# EasyEDA Pro project ProPrj_ESP32辉光钟_2025-08-24.epro, board PCB_IN12Ax4
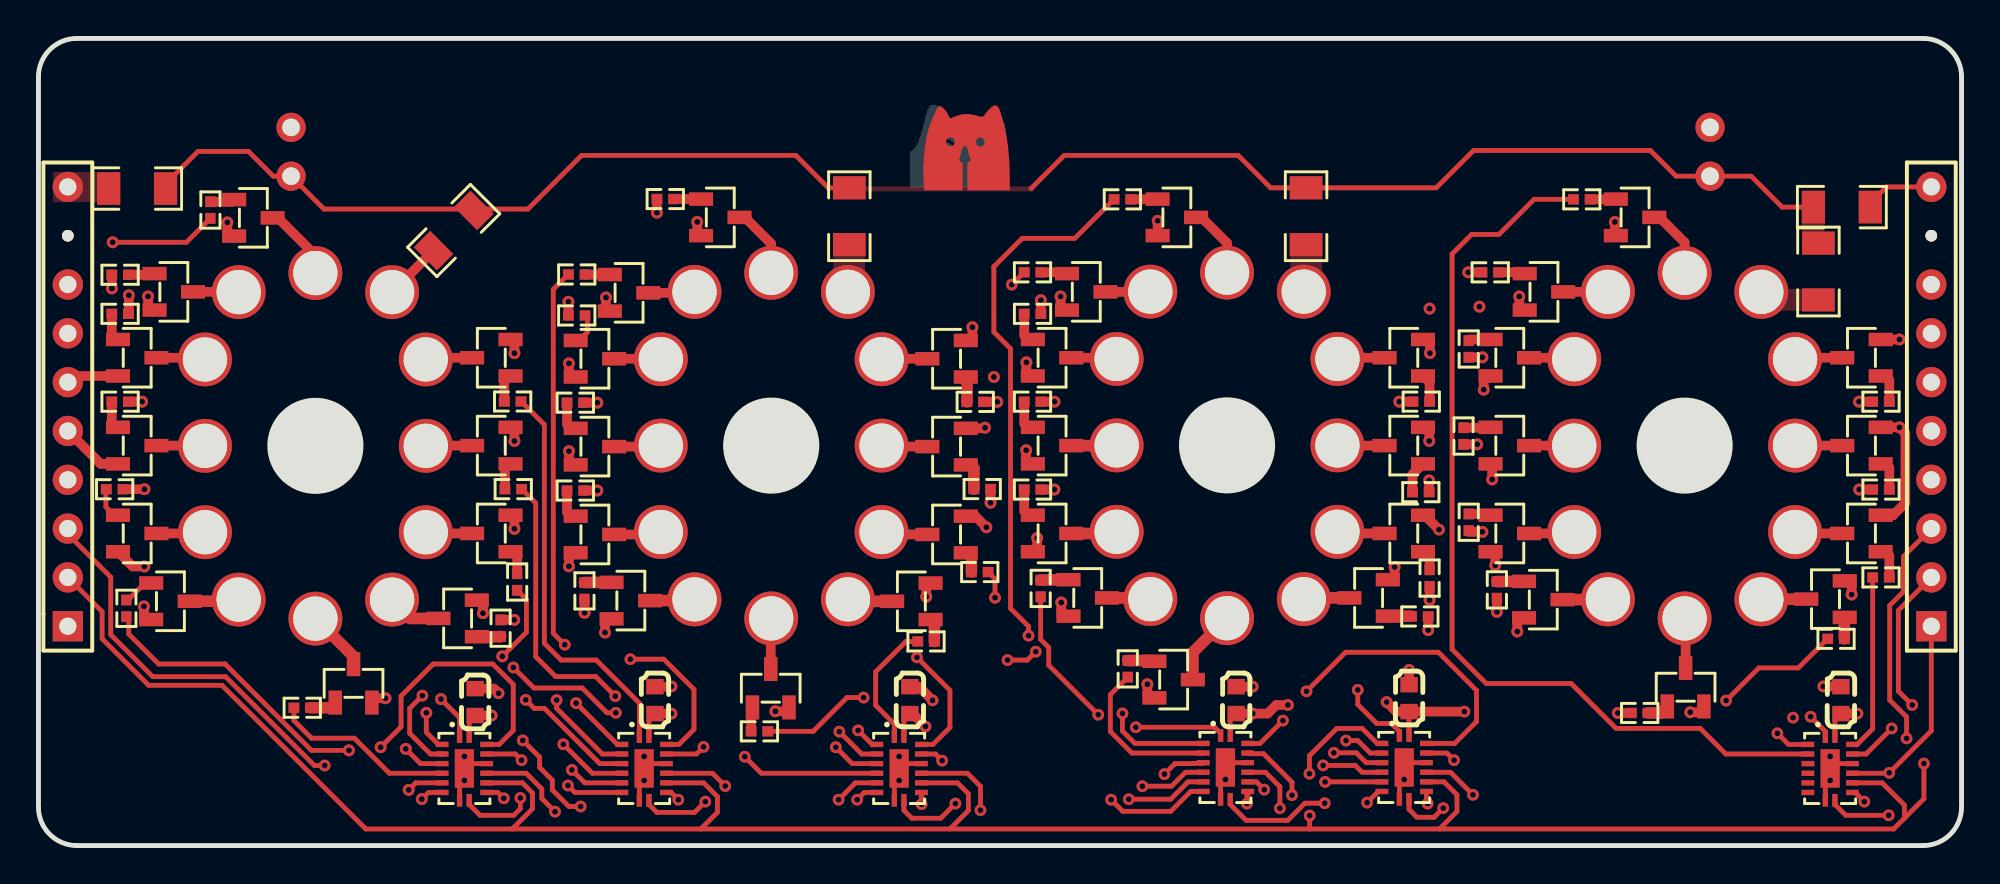
[diagram p4: board, top side]
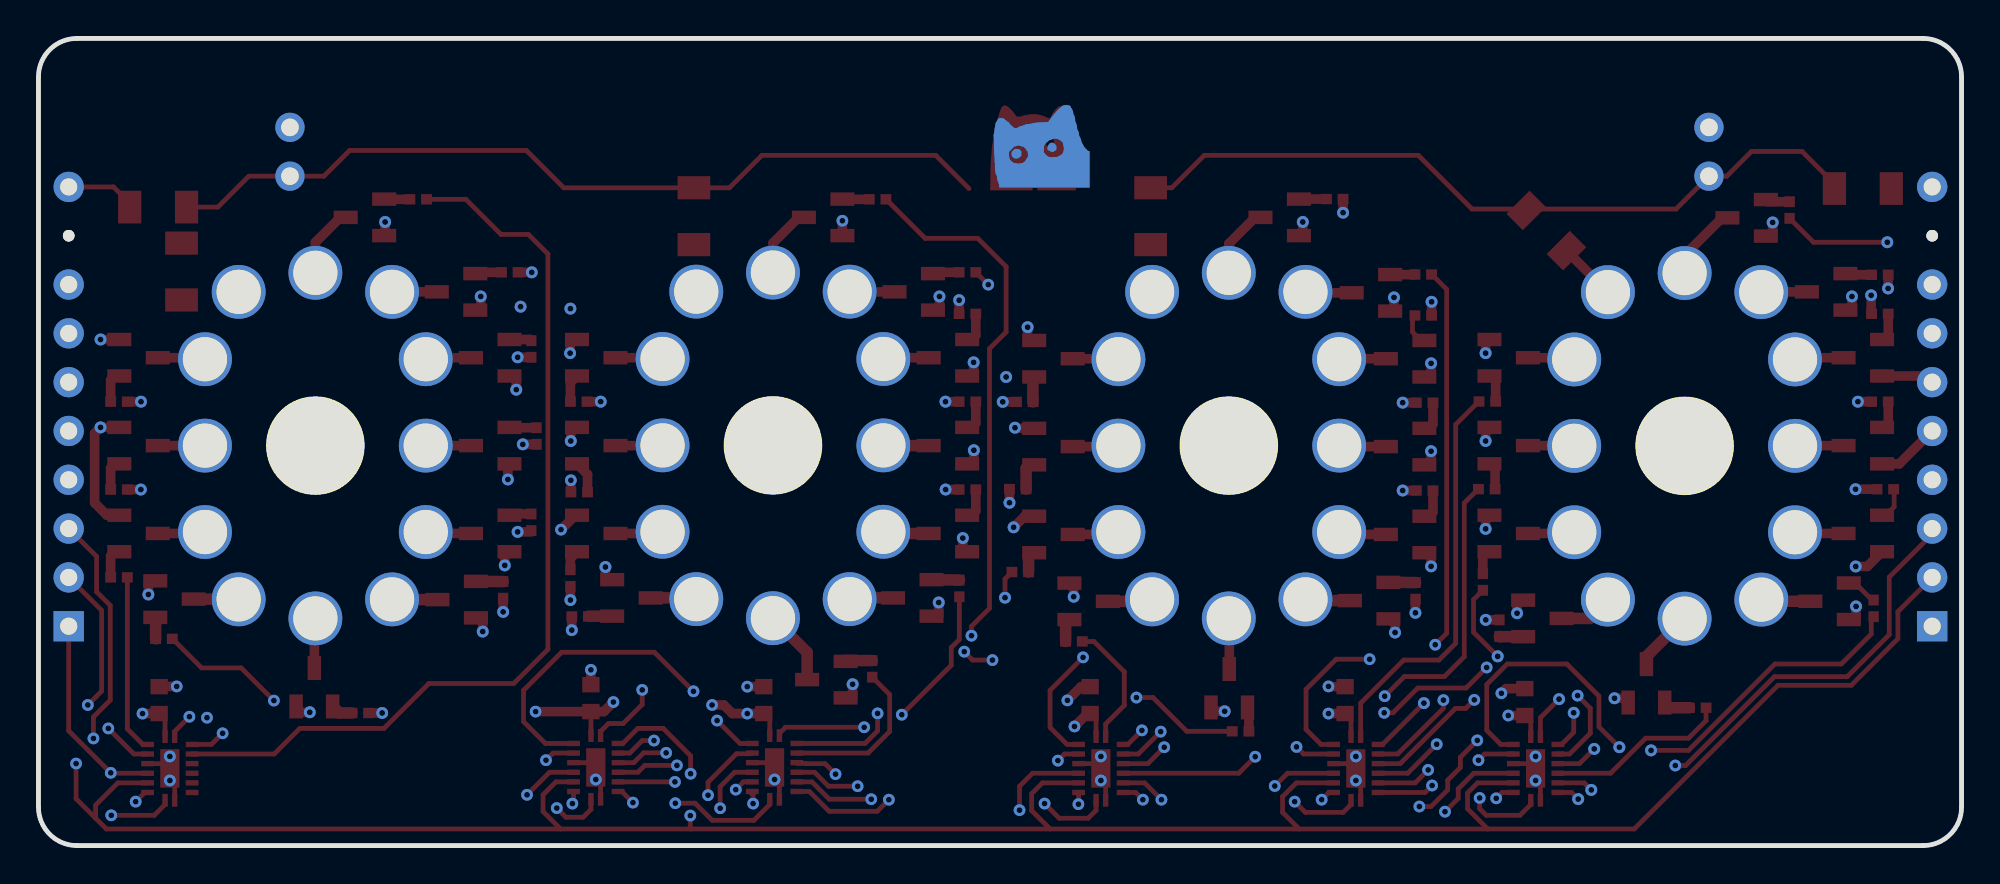
[diagram p5: board, bottom side, seen from below]

Outline 100 x 42 mm; copper layers: Top Layer, Inner1, Inner2, Bottom Layer. Coordinates in mm from the lower left corner of the outline.
Outline path: 0,40 0,2 arc(0.59,0.59) 2,0 98,0 arc(99.41,0.59) 100,2 100,40 arc(99.41,41.41) 98,42 2,42 arc(0.59,41.41) 0,40
Stack: Top Layer 0.035mm / Dielectric1 0.48mm PP er 4.5 / Inner1 0.035mm / Dielectric2 0.48mm FR4 er 4.5 / Inner2 0.035mm / Dielectric3 0.48mm PP er 4.5 / Bottom Layer 0.035mm

## Design rules (mm)
template: 用户自定义配置
spacing Default (default): track to track 0.2, other pairs 0 to 0.5
spacing dis+170v: track to track 0.75, other pairs 0 to 0.75
spacing dis+3v3: track to track 0.2, other pairs 0.152 to 0.3
track width Default (default): min 0.249, default 0.249, max 25.4
track width dis+170v: min 0.249, default 0.249, max 25.4
differential pair differentialPair (default): width min 0.127, default 0.254, max 2.54; gap min 0.152, default 0.152
via Default (default): diameter min 0.61, default 0.61, max 100.025; hole min 0.305, default 0.305, max 59.995
via dis+170v: diameter min 0.61, default 0.61, max 100.025; hole min 0.305, default 0.305, max 59.995
net $1N360 uses dis+170v
net $1N358 uses dis+170v
net $1N361 uses dis+170v
net $1N357 uses dis+170v
net $1N362 uses dis+170v
net $1N356 uses dis+170v
net $1N363 uses dis+170v
net $1N355 uses dis+170v
net $1N364 uses dis+170v
net $1N354 uses dis+170v
net $1N359 uses dis+170v
net $1N275 uses dis+170v
net $1N273 uses dis+170v
net $1N272 uses dis+170v
net $1N271 uses dis+170v
net $1N270 uses dis+170v
net $1N269 uses dis+170v
net $1N268 uses dis+170v
net $1N267 uses dis+170v
net $1N266 uses dis+170v
net $1N265 uses dis+170v
net $1N274 uses dis+170v
net $1N186 uses dis+170v
net $1N184 uses dis+170v
net $1N183 uses dis+170v
net $1N182 uses dis+170v
net $1N181 uses dis+170v
net $1N180 uses dis+170v
net $1N179 uses dis+170v
net $1N178 uses dis+170v
net $1N177 uses dis+170v
net $1N176 uses dis+170v
net $1N185 uses dis+170v
net $1N13 uses dis+170v
net $1N15 uses dis+170v
net $1N16 uses dis+170v
net $1N17 uses dis+170v
net $1N18 uses dis+170v
net $1N19 uses dis+170v
net $1N20 uses dis+170v
net $1N21 uses dis+170v
net $1N22 uses dis+170v
net $1N23 uses dis+170v
net $1N14 uses dis+170v
net PGND uses gge65401(1)
net VCC+180V_EXT1 uses dis+170v
net VCC+180V uses dis+170v
net VCC+180V_EXT2 uses dis+170v

## Placement (name value [footprint] x y rotation side)
C29  10uF  [C0603]  93.73 7.57 270 top
C30  10uF  [C0603]  32.06 7.57 270 top
C31  10uF  [C0603]  45.31 7.57 270 top
C32  10uF  [C0603]  62.28 7.57 270 top
C33  10uF  [C0603]  71.27 7.67 270 top
C34  10uF  [C0603]  22.71 7.47 270 top
DISP1  DISP_IN12A  [_IN12A]  14.4 20.8 180 bottom
DISP2  DISP_IN12A  [_IN12A]  38.1 20.81 180 bottom
DISP4  DISP_IN12A  [_IN12A]  85.6 20.81 180 bottom
DISP5  DISP_IN12A  [_IN12A]  61.81 20.82 180 bottom
J1  HDR-M-2.54_1x10  [HDR-M-2.54_1X10]  98.43 22.84 90 top
J2  HDR-M-2.54_1x10  [HDR-M-2.54_1X10]  1.53 22.84 90 top
NOREF  -  [Pad_e2]  86.92 37.37 0 top
NOREF#2  -  [Pad_e1]  13.14 37.37 0 top
NOREF#3  -  [Pad_e257]  86.92 34.83 180 top
NOREF#4  -  [Pad_e227]  13.14 34.83 180 top
Q4  DMN60H080DS-13  [SOT-23-3_L2.9-W1.3-P1.90-LS2.4-BR]  23.55 25.38 0 top
Q5  DMN60H080DS-13  [SOT-23-3_L2.9-W1.3-P1.90-LS2.4-BR]  7.04 28.81 180 top
Q6  DMN60H080DS-13  [SOT-23-3_L2.9-W1.3-P1.90-LS2.4-BR]  5.13 25.38 180 top
Q7  DMN60H080DS-13  [SOT-23-3_L2.9-W1.3-P1.90-LS2.4-BR]  5.13 20.81 180 top
Q8  DMN60H080DS-13  [SOT-23-3_L2.9-W1.3-P1.90-LS2.4-BR]  5.13 16.24 180 top
Q9  DMN60H080DS-13  [SOT-23-3_L2.9-W1.3-P1.90-LS2.4-BR]  6.86 12.71 180 top
Q10  DMN60H080DS-13  [SOT-23-3_L2.9-W1.3-P1.90-LS2.4-BR]  16.39 8.44 270 top
Q11  DMN60H080DS-13  [SOT-23-3_L2.9-W1.3-P1.90-LS2.4-BR]  21.8 11.82 0 top
Q12  DMN60H080DS-13  [SOT-23-3_L2.9-W1.3-P1.90-LS2.4-BR]  23.55 16.24 0 top
Q13  DMN60H080DS-13  [SOT-23-3_L2.9-W1.3-P1.90-LS2.4-BR]  23.55 20.81 0 top
Q14  DMN60H080DS-13  [SOT-23-3_L2.9-W1.3-P1.90-LS2.4-BR]  47.22 20.76 0 top
Q15  DMN60H080DS-13  [SOT-23-3_L2.9-W1.3-P1.90-LS2.4-BR]  47.22 16.19 0 top
Q16  DMN60H080DS-13  [SOT-23-3_L2.9-W1.3-P1.90-LS2.4-BR]  45.39 12.71 0 top
Q17  DMN60H080DS-13  [SOT-23-3_L2.9-W1.3-P1.90-LS2.4-BR]  38.08 8.19 270 top
Q18  DMN60H080DS-13  [SOT-23-3_L2.9-W1.3-P1.90-LS2.4-BR]  30.8 12.75 180 top
Q19  DMN60H080DS-13  [SOT-23-3_L2.9-W1.3-P1.90-LS2.4-BR]  28.93 16.19 180 top
Q20  DMN60H080DS-13  [SOT-23-3_L2.9-W1.3-P1.90-LS2.4-BR]  28.93 20.76 180 top
Q21  DMN60H080DS-13  [SOT-23-3_L2.9-W1.3-P1.90-LS2.4-BR]  28.93 25.33 180 top
Q22  DMN60H080DS-13  [SOT-23-3_L2.9-W1.3-P1.90-LS2.4-BR]  30.71 28.76 180 top
Q23  DMN60H080DS-13  [SOT-23-3_L2.9-W1.3-P1.90-LS2.4-BR]  47.22 25.33 0 top
Q24  DMN60H080DS-13  [SOT-23-3_L2.9-W1.3-P1.90-LS2.4-BR]  71 20.81 0 top
Q25  DMN60H080DS-13  [SOT-23-3_L2.9-W1.3-P1.90-LS2.4-BR]  71 16.24 0 top
Q26  DMN60H080DS-13  [SOT-23-3_L2.9-W1.3-P1.90-LS2.4-BR]  69.17 12.89 0 top
Q27  DMN60H080DS-13  [SOT-23-3_L2.9-W1.3-P1.90-LS2.4-BR]  59.03 8.64 180 top
Q28  DMN60H080DS-13  [SOT-23-3_L2.9-W1.3-P1.90-LS2.4-BR]  54.56 12.89 180 top
Q29  DMN60H080DS-13  [SOT-23-3_L2.9-W1.3-P1.90-LS2.4-BR]  52.71 16.24 180 top
Q30  DMN60H080DS-13  [SOT-23-3_L2.9-W1.3-P1.90-LS2.4-BR]  52.71 20.81 180 top
Q31  DMN60H080DS-13  [SOT-23-3_L2.9-W1.3-P1.90-LS2.4-BR]  52.71 25.38 180 top
Q32  DMN60H080DS-13  [SOT-23-3_L2.9-W1.3-P1.90-LS2.4-BR]  54.49 28.81 180 top
Q33  DMN60H080DS-13  [SOT-23-3_L2.9-W1.3-P1.90-LS2.4-BR]  71 25.38 0 top
Q34  DMN60H080DS-13  [SOT-23-3_L2.9-W1.3-P1.90-LS2.4-BR]  94.8 20.81 0 top
Q35  DMN60H080DS-13  [SOT-23-3_L2.9-W1.3-P1.90-LS2.4-BR]  94.8 16.24 0 top
Q36  DMN60H080DS-13  [SOT-23-3_L2.9-W1.3-P1.90-LS2.4-BR]  92.93 12.83 0 top
Q37  DMN60H080DS-13  [SOT-23-3_L2.9-W1.3-P1.90-LS2.4-BR]  85.65 8.24 270 top
Q38  DMN60H080DS-13  [SOT-23-3_L2.9-W1.3-P1.90-LS2.4-BR]  78.25 12.8 180 top
Q39  DMN60H080DS-13  [SOT-23-3_L2.9-W1.3-P1.90-LS2.4-BR]  76.51 16.24 180 top
Q40  DMN60H080DS-13  [SOT-23-3_L2.9-W1.3-P1.90-LS2.4-BR]  76.51 20.81 180 top
Q41  DMN60H080DS-13  [SOT-23-3_L2.9-W1.3-P1.90-LS2.4-BR]  76.51 25.38 180 top
Q42  DMN60H080DS-13  [SOT-23-3_L2.9-W1.3-P1.90-LS2.4-BR]  78.29 28.81 180 top
Q43  DMN60H080DS-13  [SOT-23-3_L2.9-W1.3-P1.90-LS2.4-BR]  94.8 25.38 0 top
Q44  DMN60H080DS-13  [SOT-23-3_L2.9-W1.3-P1.90-LS2.4-BR]  83.02 32.69 180 top
Q45  DMN60H080DS-13  [SOT-23-3_L2.9-W1.3-P1.90-LS2.4-BR]  59.2 32.69 180 top
Q46  DMN60H080DS-13  [SOT-23-3_L2.9-W1.3-P1.90-LS2.4-BR]  11.18 32.66 180 top
Q47  DMN60H080DS-13  [SOT-23-3_L2.9-W1.3-P1.90-LS2.4-BR]  35.46 32.69 180 top
R11  20kΩ  [R1206]  21.59 32 45 top
R26  0Ω  [R0402]  4.25 29.7 180 top
R27  0Ω  [R0402]  24.66 23.11 180 top
R28  0Ω  [R0402]  4.25 27.67 180 top
R29  0Ω  [R0402]  4.25 23.1 0 top
R30  0Ω  [R0402]  3.96 18.54 180 top
R31  0Ω  [R0402]  4.57 12.34 270 top
R32  0Ω  [R0402]  13.72 7.17 0 top
R33  0Ω  [R0402]  24.03 11.31 90 top
R34  0Ω  [R0402]  24.89 13.72 90 top
R35  0Ω  [R0402]  24.69 18.55 0 top
R36  0Ω  [R0402]  49.07 18.55 0 top
R37  0Ω  [R0402]  48.95 14.23 180 top
R38  0Ω  [R0402]  46.15 10.62 180 top
R39  0Ω  [R0402]  37.49 5.94 180 top
R40  0Ω  [R0402]  28.39 13.25 270 top
R41  0Ω  [R0402]  27.92 18.47 180 top
R42  0Ω  [R0402]  27.92 23.05 0 top
R43  0Ω  [R0402]  27.99 27.58 0 top
R44  0Ω  [R0402]  48.71 23.09 180 top
R45  0Ω  [R0402]  27.99 29.72 180 top
R46  20kΩ  [R1206]  42.17 32.75 90 top
R47  0Ω  [R0402]  71.88 18.39 0 top
R48  0Ω  [R0402]  72.34 13.92 90 top
R49  0Ω  [R0402]  71.83 11.92 0 top
R50  0Ω  [R0402]  56.64 9.19 90 top
R51  0Ω  [R0402]  52.11 13.38 270 top
R52  0Ω  [R0402]  51.69 18.53 180 top
R53  0Ω  [R0402]  51.69 23.1 0 top
R54  0Ω  [R0402]  51.69 27.67 180 top
R55  0Ω  [R0402]  71.91 23.1 0 top
R56  0Ω  [R0402]  51.69 29.83 180 top
R57  20kΩ  [R1206]  65.92 32.75 90 top
R58  0Ω  [R0402]  95.81 18.53 180 top
R59  0Ω  [R0402]  95.81 13.95 0 top
R60  0Ω  [R0402]  93.47 10.76 180 top
R61  0Ω  [R0402]  83.26 6.9 0 top
R62  0Ω  [R0402]  75.84 13.31 270 top
R63  0Ω  [R0402]  74.37 16.82 90 top
R64  0Ω  [R0402]  74.1 21.31 270 top
R65  0Ω  [R0402]  74.37 25.84 90 top
R66  0Ω  [R0402]  95.81 23.1 0 top
R67  0Ω  [R0402]  75.49 29.83 180 top
R68  20kΩ  [R1206]  92.56 29.87 90 top
R69  NULL  [R1206]  93.78 33.22 0 top
R70  NULL  [R1206]  5.13 34.19 180 top
R71  0Ω  [R0402]  80.25 33.63 180 top
R72  0Ω  [R0402]  56.37 33.63 180 top
R73  0Ω  [R0402]  8.94 33.07 270 top
R74  0Ω  [R0402]  32.59 33.64 180 top
U7  74HC595BQ,115  [DHVQFN-16_L3.5-W2.5-P0.50-BL-EP]  71.02 4.06 270 top
U8  74HC595BQ,115  [DHVQFN-16_L3.5-W2.5-P0.50-BL-EP]  61.72 4.06 270 top
U9  74HC595BQ,115  [DHVQFN-16_L3.5-W2.5-P0.50-BL-EP]  44.75 4.01 270 top
U10  74HC595BQ,115  [DHVQFN-16_L3.5-W2.5-P0.50-BL-EP]  31.5 4.01 270 top
U11  74HC595BQ,115  [DHVQFN-16_L3.5-W2.5-P0.50-BL-EP]  22.15 4.01 270 top
U12  74HC595BQ,115  [DHVQFN-16_L3.5-W2.5-P0.50-BL-EP]  93.17 4.01 270 top

## Footprints (pads in the part's own frame, mm; a bottom-side part is the same pattern mirrored in y, then rotated)
_IN12A
  round 2.8 hole 2.301: 1(-3.988,8.001) 2(-5.74,4.496) 3(-5.74,0) 4(-5.74,-4.496) 5(-3.988,-8.001) 6(0,-8.992) 7(3.988,-8.001) 8(5.74,-4.496) 9(5.74,0) 10(5.74,4.496) 11(3.988,8.001) 12(0,8.992)
C0603
  rect 0.8x0.9 smd: 1(-0.7,0) 2(0.7,0)
DHVQFN-16_L3.5-W2.5-P0.50-BL-EP
  rect 0.665x0.28 smd: 1(-1.657,-0.25) 8(1.657,-0.25) 9(1.657,0.25) 16(-1.657,0.25)
  rect 0.28x0.665 smd: 2(-1.25,-1.157) 3(-0.75,-1.157) 4(-0.25,-1.157) 5(0.25,-1.157) 6(0.75,-1.157) 7(1.25,-1.157) 10(1.25,1.157) 11(0.75,1.157) 12(0.25,1.157) 13(-0.25,1.157) 14(-0.75,1.157) 15(-1.25,1.157)
  rect 2x1 smd: 17(0,0)
HDR-M-2.54_1X10
  rect 1.575x1.575 hole 0.889: 1(-11.43,0)
  round 1.575 hole 0.889: 2(-8.89,0) 3(-6.35,0) 4(-3.81,0) 5(-1.27,0) 6(1.27,0) 7(3.81,0) 8(6.35,0) 10(11.43,0)
  round 0.6 hole 0.8: 9(8.89,0)
Pad_e1
  round 1.524 hole 0.914: 1(0,0)
Pad_e2
  round 1.524 hole 0.914: 1(0,0)
Pad_e227
  round 1.524 hole 0.914: 1(0,0)
Pad_e257
  round 1.524 hole 0.914: 1(0,0)
R0402
  rect 0.566x0.54 smd: 1(-0.433,0) 2(0.433,0)
R1206
  rect 1.208x1.701 smd: 1(-1.479,0) 2(1.479,0)
SOT-23-3_L2.9-W1.3-P1.90-LS2.4-BR
  rect 1.25x0.7 smd: 1(1,-0.95) 2(1,0.95) 3(-1,0)

## Nets
As in the schematic, except:
PGND: C29.1 C30.1 C31.1 C32.1 C33.1 C34.1 J1.5 J1.6 J1.7 J1.8 J2.5 J2.6 J2.7 J2.8 Q4.2 Q5.2 Q6.2 Q7.2 Q8.2 Q9.2 Q10.2 Q11.2 Q12.2 Q13.2 Q14.2 Q15.2 Q16.2 Q17.2 Q18.2 Q19.2 Q20.2 Q21.2 Q22.2 Q23.2 Q24.2 Q25.2 Q26.2 Q27.2 Q28.2 Q29.2 Q30.2 Q31.2 Q32.2 Q33.2 Q34.2 Q35.2 Q36.2 Q37.2 Q38.2 Q39.2 Q40.2 Q41.2 Q42.2 Q43.2 Q44.2 Q45.2 Q46.2 Q47.2 U7.8 U7.13 U7.17 U8.8 U8.13 U8.17 U9.8 U9.13 U9.17 U10.8 U10.13 U10.17 U11.8 U11.13 U11.17 U12.8 U12.13 U12.17
VCC+180V: NOREF#3.1 NOREF#4.1 R11.2 R46.2 R57.2 R68.2 R69.1 R70.1

Pads without a net: J1 9; J2 9; NOREF 1; NOREF#2 1

## Via types
v1: diameter 0.61, hole 0.305, Top Layer to Bottom Layer, 92 vias
v2: diameter 0.62, hole 0.31, Top Layer to Bottom Layer, 89 vias

## Routing (per net, layer and track width the routed paths; a pad name or vN(x,y) marks a point on that pad's centre or on a via; arc(x,y) is an arc through that point)
PGND: length 406.5
  Top Layer w0.249: U10.13 31.75,4.26 U10.17 31.25,3.76 U10.8 ; U11.8 21.9,3.76 U11.17 22.4,4.26 U11.13 ; U7.13 71.27,4.31 U7.17 70.77,3.81 U7.8 ; v2(44.75,3.39) 44.5,3.14 U9.8 ; U8.17 61.97,4.31 U8.13 ; U12.17 93.42,4.26 U12.13 ; U9.13 45,4.26 U9.17 ; v2(93.17,3.39) 92.92,3.14 92.92,2.36 ; v2(61.72,3.44) 61.47,3.19 U8.8
  Top Layer w0.5: 27.58,19.81 v2(27.58,20.52) ; v1(46.5,7.56) 45.78,8.27 C31.1 ; 24.75,17.19 v2(24.75,16.48) ; v2(70.52,14.5) 70.52,13.99 70.37,13.84 ; 9.82,31.71 v2(9.82,32.42) ; C29.1 93.72,8.28 v1(92.81,8.28) ; Q8.2 4.9,14.52 v2(5.5,14.52) ; Q35.2 96.44,17.19 97.08,17.83 97.08,21.46 v2(96.77,21.76) 96.06,21.76 ; v1(32.92,8.28) 32.91,8.27 C30.1 ; 51.36,19.86 v2(51.36,20.57) ; 34.26,31.74 v2(34.26,32.45) ; v1(23.93,7.92) 23.68,8.17 C34.1 ; J2.5 3.24,19.86 Q7.2 ; 24.75,21.76 v2(24.75,21.05) ; 48.56,26.26 v2(48.56,26.97) ; J2.6 1.85,24.43 Q6.2 ; C33.1 v1(71.27,9.14) ; 77,27.86 v2(77,28.57) ; 57.66,7.69 v2(57.66,8.4) ; 17.33,7.67 v2(18.05,7.67) ; C32.1 v1(63.14,8.27) ; 5.49,11.73 v2(5.49,12.44) ; v2(49.22,21.74) 49.19,21.71 Q14.2 ; Q45.2 v1(58.2,32.51) ; 27.58,15.24 v2(27.58,14.53) ; 24.75,26.33 v2(24.75,25.62) ; 53.15,27.86 v2(53.15,28.57) ; 29.46,11.8 v2(29.46,11.09) ; v2(49.29,16.56) 48.71,17.14 Q15.2 ; 72.32,21.76 v2(72.32,21.05) ; 94.28,13.78 v2(94.28,13.06) ; 75.16,24.43 v2(75.16,23.72) ; 81.97,31.74 v2(81.97,32.45) ; 96.06,26.33 v2(96.77,26.33) ; 76.9,11.85 v2(76.9,11.14) ; 75.75,15.29 v2(75.75,14.58) ; 5.7,27.86 v2(5.7,28.57) ; 27.58,24.38 v2(27.58,25.09) ; 23.11,12.8 v2(23.11,12.09) ; 39.03,6.99 v2(38.32,6.99) ; 51.93,15.29 v2(51.93,16) ; 72.36,26.33 v2(72.36,25.62) ; 86.6,6.94 v2(85.89,6.94) ; 53.19,11.94 v2(53.19,12.65) ; 29.51,27.81 v2(29.51,28.52) ; 51.37,24.43 v2(51.37,25.14) ; 46.17,13.66 v2(46.17,12.95) ; Q25.2 72.08,17.19 v1(72.83,16.44) ; 75.59,19.76 v2(75.59,19.05)
  Inner1 w0.5: v1(58.2,32.51) 55.37,32.51 54.31,31.44 52.41,31.44 51.34,30.38 ; 71.27,13.74 72.83,15.3 ; 71.27,13.74 v2(70.52,14.5) ; 71.27,13.74 v1(71.27,9.14) ; 72.83,15.3 v1(72.83,16.44) 73.3,16.92 ; 72.83,15.3 75.03,15.3 v2(75.75,14.58) ; 53.19,10.16 54.95,8.4 v2(57.66,8.4) 59.15,6.91 61.06,6.91 62.42,8.27 v1(63.14,8.27) ; 53.19,10.16 v2(53.19,12.65) 51.77,12.65 51.1,13.31 51.1,15.17 v2(51.93,16) 50.85,17.08 50.85,20.06 v2(51.36,20.57) ; 53.19,10.16 50.58,7.56 v1(46.5,7.56) ; v2(24.75,25.62) v2(24.75,21.05) v2(24.75,16.48) 24.75,13.73 v2(23.11,12.09) 23.11,8.74 23.27,8.58 ; 51.34,30.38 v2(53.15,28.57) ; 51.34,30.38 50.14,30.38 48.56,28.8 v2(48.56,26.97) ; 92.39,9.38 94.28,11.28 v2(94.28,13.06) 95.76,14.54 95.76,20.75 v2(96.77,21.76) 98.24,21.76 J1.5 J1.6 J1.7 J1.8 ; 92.39,9.38 91.34,8.33 87.29,8.33 v2(85.89,6.94) 83.23,6.94 82.45,7.72 78.94,7.72 76.9,9.77 v2(76.9,11.14) 74.48,11.14 73.46,10.11 72.24,10.11 v1(71.27,9.14) ; 92.39,9.38 92.81,8.96 v1(92.81,8.28) ; 48.11,11.01 48.11,15.38 v2(49.29,16.56) 48.56,17.29 48.56,21.09 v2(49.22,21.74) 48.56,22.4 v2(48.56,26.97) ; 48.11,11.01 v2(46.17,12.95) ; 48.11,11.01 48.11,9.17 v1(46.5,7.56) ; v2(48.56,26.97) 49.54,26.97 v2(51.37,25.14) ; 5.69,30.58 2.92,30.58 J2.8 J2.7 J2.6 J2.5 4.42,18.68 4.42,15.61 v2(5.5,14.52) 5.5,12.46 v2(5.49,12.44) 5.49,10.92 7.31,9.09 10.77,9.09 12.85,7.01 17.39,7.01 v2(18.05,7.67) 18.96,8.58 23.27,8.58 ; 5.69,30.58 6.4,31.29 7.77,31.29 8.64,32.16 9.55,32.16 v2(9.82,32.42) ; 5.69,30.58 5.69,28.58 v2(5.7,28.57) ; v1(63.14,8.27) 64.91,8.27 65.79,9.14 v1(71.27,9.14) ; v1(63.14,8.27) 63.9,7.51 63.9,5.62 v2(61.72,3.44) ; 29.46,9.95 30.47,8.94 32.26,8.94 v1(32.92,8.28) 34.21,6.99 v2(38.32,6.99) 40.57,6.99 42.06,8.48 45.57,8.48 v1(46.5,7.56) ; 29.46,9.95 v2(29.46,11.09) 29.45,11.07 28.36,11.07 27.58,11.85 v2(27.58,14.53) v2(27.58,20.52) v2(27.58,25.09) 27.58,26.59 v2(29.51,28.52) 29.51,30.02 31.24,31.75 33.56,31.75 v2(34.26,32.45) ; 29.46,9.95 27.94,8.43 24.44,8.43 v1(23.93,7.92) 23.27,8.58 ; v2(75.16,23.72) 75.59,23.29 v2(75.59,19.05) 75.44,19.05 73.3,16.92 ; v1(71.27,9.14) 72.39,8.03 72.39,6.45 71.02,5.08 v2(71.02,3.44) ; 73.3,16.92 73.3,20.07 v2(72.32,21.05) 72.32,25.59 v2(72.36,25.62) 74.05,25.62 v2(77,28.57) 77,30.47 78.98,32.45 v2(81.97,32.45) ; v2(93.17,4.64) 92.24,4.64 91.24,5.64 v1(91.24,6.66) ; v2(96.77,26.33) 96.77,21.76
  Inner2 w0.5: v2(44.75,4.64) 45.84,4.64 46.89,5.69 46.89,7.16 v1(46.5,7.56) ; v1(32.92,8.28) 33.78,7.42 33.78,6.45 31.97,4.64 v2(31.5,4.64) ; v1(91.24,6.66) 91.24,7.26 92.25,8.28 v1(92.81,8.28) ; v1(23.93,7.92) 24.59,7.26 24.59,5.94 23.28,4.64 v2(22.15,4.64)
  vias: v2(22.15,3.39) v2(31.5,3.39) v2(49.68,24.38) v2(72.34,27.94) v2(74.93,28.04)
VCC+3V3: length 178
  Top Layer w0.249: C34.2 22.4,6.46 22.4,5.67 ; v1(62.84,2.18) 62.84,2.63 63.02,2.81 U8.10 ; 93.42,5.67 93.42,6.56 C29.2 ; v1(72.24,2.18) 72.18,2.25 U7.10 ; v1(45.92,2.15) 45.91,2.16 U9.10 ; v1(33.27,2.39) 32.9,2.76 U10.10 ; U12.10 94.47,2.76 v1(94.94,2.29) ; U11.10 23.89,2.76 v1(24.2,2.46) ; C31.2 45,6.56 45,5.67 ; 31.75,5.67 31.75,6.56 C30.2 ; C32.2 61.97,6.56 U8.16 ; U7.16 71.27,6.97 C33.2
  Top Layer w0.5: C29.2 v1(94.59,6.87) ; C31.2 45.46,6.87 v1(46.13,6.2) ; v1(70.1,7.47) 70.6,6.97 C33.2 v1(74.15,6.97) ; v1(64.97,7.31) 64.36,7.31 63.92,6.87 v1(63.14,6.87) C32.2 ; C34.2 v1(23.57,6.77) ; C30.2 v1(32.92,6.87)
  Inner1 w0.249: v1(94.59,6.87) 93.93,6.21 93.93,3.3 v1(94.94,2.29)
  Inner1 w0.5: v1(62.84,2.18) 61.47,2.18 60.81,2.84 60.81,5.2 ; J2.4 3.72,16.84 3.72,15.28 4.62,14.38 4.62,10.72 7.01,8.33 10.54,8.33 12.57,6.3 19.3,6.3 19.8,5.8 21.14,5.8 22.1,6.76 23.56,6.76 v1(23.57,6.77) 27.37,6.77 28.55,5.59 31.64,5.59 v1(32.92,6.87) 33.74,6.05 40.69,6.05 41.59,6.95 45.38,6.95 v1(46.13,6.2) 54.05,6.2 55.05,5.2 60.81,5.2 ; 60.81,5.2 62.48,6.87 v1(63.14,6.87) ; J1.4 96.46,17.06 96.46,8.74 v1(94.59,6.87) 93.94,7.52 89.61,7.52 88.19,6.1 81.84,6.1 80.96,6.97 v1(74.15,6.97) ; v1(64.97,7.31) 65.48,6.81 69.44,6.81 v1(70.1,7.47)
  Inner2 w0.249: v1(32.92,6.87) 30.9,6.87 30.07,6.05 30.07,3.66 31.34,2.39 v1(33.27,2.39) ; v1(74.15,6.97) 71.78,4.6 71.78,2.64 v1(72.24,2.18) ; v1(45.92,2.15) 45.04,2.15 44.09,3.1 44.09,5.39 44.91,6.2 v1(46.13,6.2) ; v1(24.2,2.46) 22.13,2.46 21.28,3.3 21.28,4.93 22.35,5.99 22.8,5.99 v1(23.57,6.77)
VCC+180V: length 83.8
  Top Layer w0.249: R69.1 90.67,33.22 89.06,34.83 NOREF#3.1 85.16,34.83 83.82,36.17 74.62,36.17 72.68,34.23 R57.2 64.07,34.23 62.38,35.92 53.34,35.92 51.61,34.19 ; 22.56,33.12 14.85,33.12 NOREF#4.1 12.21,34.83 10.92,36.12 8.29,36.12 6.61,34.44 R70.1 ; 22.56,33.12 25.45,33.12 28.25,35.92 39.38,35.92 41.07,34.23 R46.2 ; 22.56,33.12 R11.2
VCC+180V_EXT1: length 3.7
  Top Layer w0.249: R69.2 95.26,33.43 96.1,34.27 J1.10
CLK: length 144.6
  Top Layer w0.249: 47.4,0.86 48.35,1.82 48.35,2.7 47.79,3.26 U9.11 ; 47.4,0.86 34.44,0.86 ; 47.4,0.86 66.09,0.86 ; 97.03,1.42 96.47,0.86 72.85,0.86 ; 97.03,1.42 98.04,2.44 v1(98.04,4.27) ; 97.03,1.42 97.03,2.11 95.87,3.26 U12.11 ; v1(63.74,2.91) 63.34,3.31 U8.11 ; J1.2 96.72,12.24 96.72,8.03 v1(97.43,7.31) ; 34.44,0.86 35.31,1.73 35.31,2.55 34.59,3.26 U10.11 ; 34.44,0.86 24.64,0.86 ; 66.09,0.86 66.1,0.88 v1(66.1,1.56) ; 66.09,0.86 72.85,0.86 ; 72.85,0.86 73.76,1.77 73.76,2.64 73.09,3.31 U7.11 ; 24.64,0.86 25.69,1.91 25.69,2.74 25.16,3.26 U11.11 ; 24.64,0.86 17.02,0.86 9.54,8.34 5.73,8.34 3.31,10.76 3.31,12.17 J2.2
  Inner2 w0.249: v1(97.43,7.31) 98.04,6.71 v1(98.04,4.27) ; v1(66.1,1.56) 66.1,2.83 65.68,3.25 64.08,3.25 v1(63.74,2.91)
DI: length 36.9
  Top Layer w0.249: v1(14.88,4.17) 14.35,4.17 9.73,8.79 5.94,8.79 3.76,10.97 3.76,13.97 1.53,16.2 J2.3 ; U11.14 24.8,4.76 v1(25.12,4.44)
  Inner2 w0.249: v1(14.88,4.17) 17.28,1.77 25.24,1.77 25.81,2.34 25.81,3.76 v1(25.12,4.44)
DQ: length 19.8
  Top Layer w0.249: U12.9 93.42,2.14 93.98,1.57 v1(96.22,1.57) ; J1.3 96.98,15.04 96.98,13.21 96.27,12.5 96.27,7.57 97.14,6.69 v1(97.14,5.58)
  Inner2 w0.249: v1(96.22,1.57) 97.14,2.5 v1(97.14,5.58)
EN00: length 21.1
  Top Layer w0.249: 31.25,5.67 31.25,7.41 29.01,9.65 27.18,9.65 26.31,10.52 26.31,21.9 25.1,23.11 R27.1
EN01: length 50.2
  Top Layer w0.249: U11.15 23.96,5.26 24.69,5.99 24.69,8.38 23.62,9.45 20.52,9.45 18.86,7.78 18.86,6.18 v2(17.79,5.12)
  Top Layer w0.5: 3.82,29.7 v2(3.82,28.99)
  Inner2 w0.249: v2(3.82,28.99) 3.81,28.98 3.81,27.43 4.25,26.99 4.25,21.17 3.34,20.26 3.34,11.08 6.35,8.08 10.16,8.08 12.65,5.59 17.32,5.59 v2(17.79,5.12)
EN02: length 41.6
  Top Layer w0.249: 21.9,5.67 21.9,6.65 v2(20.93,7.62)
  Top Layer w0.5: R28.1 4.7,27.69 v2(4.7,28.63)
  Inner2 w0.249: v2(4.7,28.63) 4.7,20.91 3.79,20 3.79,11.27 6.54,8.53 10.35,8.53 12.83,6.04 20.26,6.04 20.93,6.71 v2(20.93,7.62)
EN03: length 33.1
  Top Layer w0.249: v2(20.17,6.91) 20.17,5.89 20.8,5.26 U11.2
  Top Layer w0.5: R29.2 v2(5.39,23.1)
  Inner2 w0.249: v2(5.39,23.1) 5.39,19.76 4.24,18.62 4.24,11.45 6.72,8.97 10.53,8.97 13.02,6.49 19.75,6.49 v2(20.17,6.91)
EN04: length 30.3
  Top Layer w0.249: v1(19.96,7.8) 19.3,7.14 19.3,5.84 20.38,4.76 U11.3
  Top Layer w0.5: 4.39,18.54 v2(5.51,18.54)
  Inner2 w0.249: v1(19.96,7.8) 19.1,6.94 13.21,6.94 10.72,9.42 6.91,9.42 4.69,11.64 4.69,17.72 v2(5.51,18.54)
EN05: length 20.7
  Top Layer w0.249: U11.4 19.87,4.26 v2(19.1,5.03) ; v2(16.15,4.95) 14.2,4.95 9.7,9.45 6.25,9.45 4.69,11 4.69,11.95
  Inner2 w0.249: v2(16.15,4.95) 16.83,4.27 18.34,4.27 v2(19.1,5.03)
EN06: length 9.5
  Top Layer w0.249: U11.5 18.25,3.76 16.43,5.59 14.2,5.59 13.29,6.5 13.29,7.17
EN07: length 13.7
  Top Layer w0.249: U11.6 19.62,3.26 v2(19.25,2.9)
  Top Layer w0.5: R33.2 v2(24.74,11.74)
  Inner2 w0.249: v2(24.74,11.74) 21.59,8.59 21.59,6.5 19.25,4.17 v2(19.25,2.9)
EN08: length 14.5
  Top Layer w0.249: U11.7 20.28,2.76 v2(19.93,2.42) ; 24.89,13.28 25.38,12.8 25.38,11.1 v2(24.12,9.85)
  Inner2 w0.249: v2(24.12,9.85) 22.04,7.76 22.04,6.32 19.93,4.21 v2(19.93,2.42)
EN09: length 24.1
  Top Layer w0.249: v1(30.78,9.7) 32.52,9.7 34.09,8.13 34.09,6.05 33.3,5.26 U10.15 ; R35.2 25.13,18.55 25.86,17.82 25.86,9.83 26.89,8.8 28.97,8.8 v1(30,7.77)
  Inner2 w0.249: v1(30.78,9.7) 30.78,8.56 v1(30,7.77)
EN10: length 26.3
  Top Layer w0.249: v1(41.46,5.12) 42.31,4.26 U9.4
  Top Layer w0.5: R44.1 v2(49.86,23.09)
  Inner2 w0.249: v2(49.86,23.09) 49.86,19.12 48.66,17.92 48.66,11.88 43.85,7.07 41.79,7.07 40.98,6.25 40.98,5.6 v1(41.46,5.12)
EN010: length 63.4
  Top Layer w0.249: v2(3.86,31.39) 7.7,31.39 R73.2 ; U10.2 30.11,5.26 v2(27.96,7.41)
  Inner2 w0.249: v2(27.96,7.41) 27.96,5.05 26.26,3.34 26.26,2.15 25.43,1.32 16.07,1.32 9.77,7.62 6.17,7.62 2.9,10.9 2.9,28.97 3.86,29.93 v2(3.86,31.39)
EN11: length 27.7
  Top Layer w0.249: v1(27.37,10.45) 26.77,11.05 26.77,28.94 27.55,29.72 R45.2 ; U10.3 29.32,4.76 26.94,7.14 v1(26.94,7.57)
  Inner2 w0.249: v1(27.37,10.45) 26.94,10.03 v1(26.94,7.57)
EN12: length 28.7
  Top Layer w0.249: v1(25.34,7.58) 25.78,7.14 26.31,7.14 29.19,4.26 U10.4
  Top Layer w0.5: R43.1 v2(27.56,28.29)
  Inner2 w0.249: v2(27.56,28.29) 25.86,26.59 25.86,8.1 v1(25.34,7.58)
EN13: length 23.7
  Top Layer w0.249: U10.5 28.8,3.76 v1(27.29,5.27)
  Top Layer w0.5: 28.35,23.05 v2(29.06,23.05)
  Inner2 w0.249: v1(27.29,5.27) 26.31,6.25 26.31,20.3 v2(29.06,23.05)
EN14: length 20.3
  Top Layer w0.249: U10.6 28.41,3.26 v1(27.74,3.94)
  Top Layer w0.5: 28.35,18.47 v2(29.06,18.47)
  Inner2 w0.249: v1(27.74,3.94) 28.75,4.95 28.75,9.96 26.76,11.95 26.76,16.18 v2(29.06,18.47)
EN15: length 14.2
  Top Layer w0.249: v1(27.53,3.13) 27.89,2.76 U10.7
  Top Layer w0.5: 28.4,12.82 v2(28.4,12.11)
  Inner2 w0.249: v2(28.4,12.11) 28.4,10.95 29.31,10.03 29.31,4.11 28.32,3.13 v1(27.53,3.13)
EN16: length 15.6
  Top Layer w0.249: R39.1 40.28,5.94 42.04,7.7 v1(42.91,7.7) ; v1(45.68,9.79) 47.4,8.08 47.4,6.15 46.51,5.26 U9.15
  Inner2 w0.249: v1(42.91,7.7) 43.59,7.7 v1(45.68,9.79)
EN17: length 6.6
  Top Layer w0.249: 44.5,5.67 44.5,6.33 43.54,7.3 43.54,9.04 45.11,10.62 45.72,10.62 R38.2
EN18: length 13.4
  Top Layer w0.249: v2(49.74,12.9) 49.74,13.87 R37.1 ; U9.2 43.35,5.26 v1(42.62,5.99)
  Inner2 w0.249: v2(49.74,12.9) 49.74,11.69 44.04,5.99 v1(42.62,5.99)
EN19: length 19.7
  Top Layer w0.249: U9.3 42.81,4.76 v1(41.65,5.93)
  Top Layer w0.5: R36.2 v2(49.51,17.84)
  Inner2 w0.249: v2(49.51,17.84) 49.93,17.42 49.93,15.03 49.11,14.21 49.11,11.69 44.04,6.62 42.34,6.62 v1(41.65,5.93)
EN20: length 37.7
  Top Layer w0.249: v1(55.78,2.39) 56.38,1.78 58.88,1.78 59.91,2.81 U8.7
  Top Layer w0.5: R55.1 v2(70.76,23.1)
  Inner2 w0.249: v1(55.78,2.39) 55.78,3.61 57.84,5.67 64.76,5.67 66.6,7.5 66.6,8.89 71.48,13.77 71.48,22.39 v2(70.76,23.1)
EN21: length 36.1
  Top Layer w0.249: 51.22,29.8 v1(50.61,29.19) ; U9.6 42.48,3.26 v1(41.6,2.39)
  Inner2 w0.249: v1(50.61,29.19) 49.61,29.19 47.76,27.34 47.76,13.39 43.2,8.84 42.29,8.84 40.08,6.63 40.08,3.92 v1(41.6,2.39)
EN22: length 34
  Top Layer w0.249: U9.7 42.95,2.76 v1(42.57,2.39)
  Top Layer w0.5: R54.1 v2(52.12,28.38)
  Inner2 w0.249: v1(42.57,2.39) 40.53,4.43 40.53,6.44 42.48,8.39 43.39,8.39 48.21,13.21 48.21,24.4 52.15,28.34
EN23: length 33.8
  Top Layer w0.249: v1(51.86,10.09) 51.42,9.65 v1(50.39,9.65) ; U8.15 63.52,5.31 v1(64.71,6.5)
  Top Layer w0.5: R53.2 v2(52.84,23.1)
  Inner2 w0.249: v1(50.39,9.65) 50.39,20.73 52.76,23.1 v2(52.84,23.1) ; v1(64.71,6.5) 64.32,6.11 58.02,6.11 56.63,7.51 55.03,7.51 52.44,10.09 v1(51.86,10.09)
EN24: length 22.4
  Top Layer w0.249: v1(57.06,6.16) 61.15,6.16 61.47,5.84 U8.1
  Top Layer w0.5: 52.12,18.53 v2(52.83,18.53)
  Inner2 w0.249: v2(52.83,18.53) 50.84,16.54 50.84,10.16 54.85,6.16 v1(57.06,6.16)
EN25: length 14
  Top Layer w0.249: U8.2 57.02,5.31 56.37,5.97 v1(56.37,6.88) ; 52.11,12.95 52.11,10.73 52.53,10.31 52.53,9.38 v1(55.11,6.81)
  Inner2 w0.249: v1(56.37,6.88) 56.3,6.81 v1(55.11,6.81)
EN26: length 8.5
  Top Layer w0.249: R50.1 55.74,7.86 55.74,5.93 56.86,4.81 U8.3
EN27: length 20.6
  Top Layer w0.249: U8.4 60.53,4.28 60.1,4.28 60.08,4.26 59.1,4.26 v1(58.55,3.72)
  Top Layer w0.5: R49.2 v2(72.27,11.21)
  Inner2 w0.249: v1(58.55,3.72) 59.15,4.32 65.32,4.32 67.97,6.97 67.97,8.36 70.82,11.21 v2(72.27,11.21)
EN28: length 24.3
  Top Layer w0.249: U8.5 59.64,3.81 58.92,3.09 v1(57.4,3.09)
  Top Layer w0.5: R48.1 v2(72.34,12.78)
  Inner2 w0.249: v2(72.34,12.78) 71.75,12.78 67.51,8.53 67.51,7.14 65.13,4.77 58.41,4.77 57.4,3.76 v1(57.4,3.09)
EN29: length 31.9
  Top Layer w0.249: v1(56.7,2.41) 58.88,2.41 59.78,3.31 U8.6
  Top Layer w0.5: R47.2 v1(72.31,19.01)
  Inner2 w0.249: v1(56.7,2.41) 56.7,3.76 58.15,5.22 64.95,5.22 67.05,7.31 67.05,8.7 71.92,13.58 71.92,18.62 v1(72.31,19.01)
EN30: length 23.5
  Top Layer w0.249: U12.2 91,5.26 v1(90.42,5.84)
  Top Layer w0.5: R66.1 v2(94.67,23.1)
  Inner2 w0.249: v1(90.42,5.84) 92.18,5.84 95.8,9.47 95.8,21.97 v2(94.67,23.1)
EN31: length 29.7
  Top Layer w0.249: v1(68.6,8.1) 68.6,7.34 69.6,6.35 70.36,6.35 70.77,5.94 U7.1
  Top Layer w0.5: R67.2 v2(74.35,29.83)
  Inner2 w0.249: v1(68.6,8.1) 71.07,10.57 72.52,10.57 73.55,11.6 73.55,16.96 73.91,17.32 73.91,20.25 73.57,20.59 73.57,29.05 v2(74.35,29.83)
EN32: length 32.9
  Top Layer w0.249: U7.2 69.62,5.31 68.83,6.1 67.51,6.1 66.09,4.67 v1(66.09,3.74)
  Top Layer w0.5: R65.1 v2(75.08,25.41)
  Inner2 w0.249: v1(66.09,3.74) 66.09,4.45 69.23,7.59 69.23,8.09 71.26,10.12 72.71,10.12 74,11.41 74,16.77 74.36,17.14 74.36,20.43 74.02,20.78 74.02,23.48 75.08,24.55 v2(75.08,25.41)
EN33: length 21.7
  Top Layer w0.249: v1(67.99,5.46) 68.6,5.46 69.25,4.81 U7.3
  Top Layer w0.5: R64.2 v2(74.81,20.88)
  Inner2 w0.249: v2(74.81,20.88) 74.81,16.95 74.45,16.59 74.45,10.92 68.99,5.46 v1(67.99,5.46)
EN34: length 19.1
  Top Layer w0.249: v1(67.36,4.83) 68.53,4.83 69.04,4.31 U7.4
  Top Layer w0.5: 74.37,16.32 v2(75.08,16.32)
  Inner2 w0.249: v1(67.36,4.83) 68.99,4.83 75.08,10.92 v2(75.08,16.32)
EN35: length 16.9
  Top Layer w0.249: v1(66.8,4.17) 68.47,4.17 68.83,3.81 U7.5
  Top Layer w0.5: 75.84,12.87 v2(75.84,12.16)
  Inner2 w0.249: v2(75.84,12.16) 75.84,11.02 68.99,4.17 v1(66.8,4.17)
EN36: length 22.3
  Top Layer w0.249: U7.6 v1(66.9,3.31)
  Top Layer w0.5: 82.84,6.9 v2(82.13,6.9)
  Inner2 w0.249: v1(66.9,3.31) 68.85,3.31 74.73,9.19 79.83,9.19 v2(82.13,6.9)
EN37: length 31
  Top Layer w0.249: v1(87.76,7.54) 89.46,9.25 91.52,9.25 93.03,10.76 R60.2 ; U7.7 69.67,2.81 v1(69.09,2.23)
  Inner2 w0.249: v1(69.09,2.23) 69.09,2.92 74.9,8.74 79.35,8.74 81.84,6.25 86.46,6.25 v1(87.76,7.54)
EN38: length 9.3
  Top Layer w0.249: R59.1 95.38,6.07 94.57,5.26 U12.15
EN39: length 15.5
  Top Layer w0.249: v1(92.15,6.71) 92.92,5.94 92.92,5.67
  Top Layer w0.5: 95.39,18.53 v2(94.68,18.53)
  Inner2 w0.249: v1(92.15,6.71) 95.35,9.91 95.35,17.85 v2(94.68,18.53)
EN110: length 52.6
  Top Layer w0.249: U9.5 37.59,3.76 v1(36.73,4.62) ; v1(24.69,9.27) 25.76,8.2 28.28,8.2 29.57,6.91 v1(30.02,6.91)
  Top Layer w0.5: R74.2 v2(32.16,32.93)
  Inner2 w0.249: v1(30.02,6.91) 32.11,8.99 33.99,8.99 35.97,7.02 35.97,5.39 v1(36.73,4.62) ; v1(24.69,9.27) 25.4,9.97 25.4,28.4 29.94,32.93 v2(32.16,32.93)
EN210: length 59.6
  Top Layer w0.249: v1(51.48,10.92) 51.48,11.41 50.55,12.34 50.55,25.86 49.68,26.72 49.68,30.12 51.16,31.6 53.89,31.6 55.92,33.63 R72.2 ; v1(65.94,8.03) 67.97,10.06 72.8,10.06 74.78,8.08 74.78,6.45 73.64,5.31 U7.15
  Inner2 w0.249: v1(65.94,8.03) 64.11,8.03 63.72,7.64 61.34,7.64 60.44,6.74 58.03,6.74 56.81,7.96 55.21,7.96 52.25,10.92 v1(51.48,10.92)
EN310: length 48.8
  Top Layer w0.249: U12.3 87.74,4.76 86.41,6.1 82.03,6.1 79.7,8.43 75.29,8.43 73.51,10.21 73.51,30.79 74.52,31.8 75.95,31.8 77.77,33.63 79.82,33.63
LOCK: length 138.9
  Top Layer w0.249: v1(74.59,2.64) 73.42,3.81 U7.12 ; v1(26.86,1.76) 26.17,2.45 26.17,2.95 25.36,3.76 U11.12 ; J1.1 98.43,5.97 v1(96.24,3.78) 96.22,3.76 U12.12 ; v1(64.55,1.94) 64.55,3.06 63.8,3.81 U8.12 ; U9.12 48.31,3.76 48.98,3.09 v1(48.98,1.84) ; v1(35.71,3.1) 35.05,3.76 U10.12
  Inner2 w0.249: v1(96.24,3.78) 96.24,2.57 94.55,0.87 73.82,0.87 ; v1(26.86,1.76) 26.73,1.76 25.84,0.87 ; 35.11,0.87 35.71,1.47 v1(35.71,3.1) ; 35.11,0.87 48.01,0.87 ; 35.11,0.87 25.84,0.87 ; 63.48,0.87 v1(64.55,1.94) ; 63.48,0.87 48.01,0.87 ; 63.48,0.87 73.82,0.87 ; 73.82,0.87 74.59,1.65 v1(74.59,2.64) ; 25.84,0.87 15.79,0.87 9.5,7.16 5.78,7.16 J2.1 ; 48.01,0.87 v1(48.98,1.84)
$1N13: length 3
  Top Layer w0.5: DISP1.1 R11.1
$1N14: length 2.2
  Top Layer w0.5: 20.15,25.31 20.22,25.38 22.31,25.38
$1N15: length 2.1
  Top Layer w0.5: 8.27,28.81 10.42,28.81
$1N16: length 2.3
  Top Layer w0.5: 8.66,25.31 8.59,25.38 6.37,25.38
$1N17: length 2.3
  Top Layer w0.5: 6.37,20.81 8.66,20.81
$1N18: length 2.3
  Top Layer w0.5: 6.37,16.24 8.59,16.24 8.66,16.32
$1N19: length 2.4
  Top Layer w0.6: 8.1,12.71 10.32,12.71 10.42,12.81
$1N20: length 3
  Top Layer w0.6: 14.41,11.82 16.39,9.84 16.39,9.68
$1N22: length 2.2
  Top Layer w0.5: 20.15,16.32 20.22,16.24 22.31,16.24
$1N23: length 2.2
  Top Layer w0.5: 22.31,20.81 20.15,20.81
$1N90: length 1.1
  Top Layer w0.5: 24.22,23.11 24.22,24.26
$1N91: length 1.2
  Top Layer w0.5: 5.8,29.76 5.74,29.7 R26.1
$1N92: length 1.4
  Top Layer w0.5: R28.2 3.81,26.42 3.9,26.33
$1N93: length 1.4
  Top Layer w0.5: R29.1 3.81,21.85 3.9,21.76
$1N96: length 1.3
  Top Layer w0.6: R32.2 15.4,7.17 15.44,7.21
$1N98: length 1.5
  Top Layer w0.5: Q12.1 24.89,15.29 R34.2
$1N99: length 1.1
  Top Layer w0.5: 24.26,18.55 24.26,19.7
$1N100: length 1.3
  Top Layer w0.6: 48.46,19.81 48.64,19.63 R36.1
$1N101: length 1
  Top Layer w0.6: 48.46,15.24 48.51,15.18 R37.2
$1N102: length 1.2
  Top Layer w0.6: 46.63,11.76 46.59,11.72 R38.1
$1N103: length 1.3
  Top Layer w0.5: R39.2 37.06,7.12 Q17.1
$1N104: length 1.2
  Top Layer w0.6: 28.39,13.69 29.57,13.7
$1N105: length 1.4
  Top Layer w0.5: R41.2 27.48,17.35 27.7,17.14
$1N106: length 1.4
  Top Layer w0.5: R42.1 27.48,21.92 27.7,21.71
$1N176: length 2.2
  Top Layer w0.5: 45.99,20.76 43.82,20.76
$1N177: length 2.2
  Top Layer w0.5: 45.99,16.19 43.89,16.19 43.82,16.27
$1N178: length 2.1
  Top Layer w0.6: 42.07,12.76 42.12,12.71 44.16,12.71
$1N179: length 2.3
  Top Layer w0.5: 38.08,9.42 38.08,11.77
$1N180: length 2.1
  Top Layer w0.6: 32.04,12.75 34.09,12.76
$1N181: length 2.2
  Top Layer w0.5: 30.17,16.19 32.26,16.19 32.34,16.27
$1N182: length 2.2
  Top Layer w0.5: 30.17,20.76 32.34,20.76
$1N183: length 2.2
  Top Layer w0.5: 30.17,25.33 32.26,25.33 32.34,25.26
$1N184: length 2.1
  Top Layer w0.5: 31.95,28.76 34.09,28.76
$1N185: length 2.2
  Top Layer w0.5: 43.82,25.26 43.89,25.33 45.99,25.33
$1N187: length 1.7
  Top Layer w0.5: R47.1 71.45,19.31 Q24.1
$1N188: length 1.1
  Top Layer w0.5: R48.2 72.34,14.95 Q25.1
$1N190: length 1.4
  Top Layer w0.6: Q27.1 57.99,9.63 R50.2
$1N191: length 1.2
  Top Layer w0.6: 53.33,13.84 52.11,13.81
$1N192: length 1.4
  Top Layer w0.5: R52.2 51.26,17.4 51.47,17.19
$1N193: length 1.4
  Top Layer w0.5: R53.1 51.26,21.98 51.47,21.76
$1N194: length 1.4
  Top Layer w0.5: R54.2 51.26,26.55 51.47,26.33
$1N195: length 1.2
  Top Layer w0.5: 53.25,29.76 53.19,29.83 R56.1
$1N196: length 1.5
  Top Layer w0.5: R55.2 72.34,24.09 Q33.1
$1N265: length 2.2
  Top Layer w0.5: 69.76,20.81 67.59,20.81
$1N266: length 2.2
  Top Layer w0.5: 67.59,16.32 67.67,16.24 69.76,16.24
$1N267: length 2.1
  Top Layer w0.6: 65.84,12.81 65.91,12.89 67.93,12.89
$1N268: length 3.9
  Top Layer w0.6: DISP5.6 60.03,10.06 Q27.3
$1N269: length 2.1
  Top Layer w0.6: 55.8,12.89 57.79,12.89 57.86,12.81
$1N270: length 2.2
  Top Layer w0.6: 53.94,16.24 56.04,16.24 56.11,16.32
$1N271: length 2.2
  Top Layer w0.6: 53.94,20.81 56.11,20.81
$1N272: length 2.2
  Top Layer w0.5: 56.11,25.31 56.04,25.38 53.94,25.38
$1N273: length 2.1
  Top Layer w0.5: 55.72,28.81 57.86,28.81
$1N274: length 2.2
  Top Layer w0.5: 69.76,25.38 67.67,25.38 67.59,25.31
$1N276: length 1.4
  Top Layer w0.5: 96.03,19.86 96.25,19.65 R58.1
$1N277: length 1.4
  Top Layer w0.5: 96.03,15.29 96.25,15.08 R59.2
$1N278: length 1.1
  Top Layer w0.6: R60.1 93.91,11.86 Q36.1
$1N279: length 1.1
  Top Layer w0.6: R61.2 84.36,6.9 Q37.1
$1N280: length 1.2
  Top Layer w0.6: 77.01,13.75 75.84,13.74
$1N281: length 1.3
  Top Layer w0.25: 75.27,17.19 75.21,17.26 75.54,17.26
  Top Layer w0.5: 75.21,17.26 R63.2
$1N284: length 1.2
  Top Layer w0.5: R67.1 76.99,29.83 77.05,29.76
$1N285: length 1.4
  Top Layer w0.5: R66.2 96.25,24.22 96.03,24.43
$1N354: length 2.2
  Top Layer w0.5: 93.56,20.81 91.39,20.81
$1N355: length 2.1
  Top Layer w0.6: 91.69,12.83 89.64,12.81
$1N356: length 2.2
  Top Layer w0.6: 79.49,12.8 81.66,12.81
$1N357: length 2.2
  Top Layer w0.5: 77.74,20.81 79.91,20.81
$1N358: length 2.1
  Top Layer w0.5: 79.52,28.81 81.66,28.81
$1N359: length 2.2
  Top Layer w0.5: 93.56,25.38 91.47,25.38 91.39,25.31
$1N361: length 2.2
  Top Layer w0.5: 79.91,25.31 79.84,25.38 77.74,25.38
$1N362: length 2.2
  Top Layer w0.5: 77.74,16.24 79.84,16.24 79.91,16.32
$1N363: length 2.3
  Top Layer w0.5: 85.65,9.47 85.65,11.82
$1N364: length 2.2
  Top Layer w0.5: 93.56,16.24 91.47,16.24 91.39,16.32
$1N29463: length 1.3
  Top Layer w0.5: Q44.1 82.01,33.63 80.69,33.63
$1N29470: length 3.7
  Top Layer w0.5: Q44.3 84.3,32.69 85.6,31.39 DISP4.12
$1N29555: length 1.4
  Top Layer w0.5: R72.1 58.19,33.63 Q45.1
$1N29562: length 3.7
  Top Layer w0.5: Q45.3 60.47,32.69 61.81,31.35 DISP5.12
$1N29644: length 1.3
  Top Layer w0.5: R73.1 10.07,33.5 Q46.1
$1N29654: length 4
  Top Layer w0.5: Q46.3 12.45,32.66 14.4,30.72 DISP1.12
$1N29736: length 1.4
  Top Layer w0.5: R74.1 34.45,33.64 Q47.1
$1N29746: length 3.7
  Top Layer w0.5: Q47.3 36.73,32.69 38.1,31.32 DISP2.12
$2N21: length 24.3
  Top Layer w0.249: v1(25.06,2.48) 25.06,1.92 24.71,1.57 22.96,1.57 22.4,2.14 22.4,2.36 ; v1(25.18,5.47) 26.06,4.6 26.06,4.06 26.72,3.4 26.72,2.9 27.58,2.03 v1(28.19,2.03) ; U10.14 34.21,4.76 v1(34.58,5.13)
  Inner2 w0.249: v1(25.06,2.48) 25.06,2.54 24.23,3.37 24.23,4.52 v1(25.18,5.47) ; v1(34.58,5.13) 33.99,4.54 33.99,2.21 33.1,1.32 28.91,1.32 v1(28.19,2.03)
$2N22: length 21.8
  Top Layer w0.249: v1(46.99,4.42) 46.65,4.76 U9.14 ; U10.9 31.75,2.14 32.16,1.73 34.12,1.73 v1(34.68,2.29)
  Inner2 w0.249: v1(34.68,2.29) 34.68,3.23 35.25,3.81 36.88,3.81 39.37,1.32 46.03,1.32 46.99,2.29 v1(46.99,4.42)
$2N23: length 26.1
  Top Layer w0.249: v1(47.68,2.18) 46.92,1.42 45.41,1.42 45,1.83 U9.9 ; v1(65.18,2.62) 65.18,3.3 63.7,4.78 63.03,4.78 62.99,4.81 U8.14
  Inner2 w0.249: v1(65.18,2.62) 64.34,2.62 63.09,1.37 50.8,1.37 49.43,2.74 48.19,2.74 47.68,2.23 v1(47.68,2.18)
$2N24: length 17.8
  Top Layer w0.249: U8.9 61.97,2.14 62.8,1.31 64.97,1.31 65.86,2.2 v1(66.88,2.2) ; v1(73.61,4.44) 73.24,4.81 U7.14
  Inner2 w0.249: v1(73.61,4.44) 73.97,4.09 73.97,1.98 73.31,1.32 67.77,1.32 v1(66.88,2.2)
$2N2665: length 37.1
  Top Layer w0.249: U12.14 95.03,4.76 v1(96.37,6.1) ; v1(73.05,1.95) 72.57,1.47 71.68,1.47 71.27,1.88 U7.9
  Inner2 w0.249: v1(96.37,6.1) 96.37,4.93 92.76,1.32 76.86,1.32 75.24,2.95 75.24,4.17 74.12,5.28 73.35,5.28 72.59,4.52 72.59,3.35 73.05,2.9 v1(73.05,1.95)
$1N21: length 2.8
  Top Layer w0.6: 18.34,12.81 19.33,11.82 20.75,11.82
$1N94: length 1.7
  Top Layer w0.25: R30.2 3.51,18.52 3.51,17.63 3.94,17.19 4.11,17.19
$1N95: length 1.5
  Top Layer w0.25: 4.69,12.82 5.54,13.66 5.82,13.66
$1N97: length 1.2
  Top Layer w0.6: 22.82,10.87 24.02,10.87 R33.1
$1N107: length 1.8
  Top Layer w0.25: 27.89,26.28 28.11,26.28 28.55,26.72 28.55,27.46 R43.2
$1N108: length 1.3
  Top Layer w0.5: 28.4,29.73 28.42,29.71 29.67,29.71
$1N109: length 1.3
  Top Layer w0.6: 48.29,23.09 48.29,24.36
$1N189: length 1.2
  Top Layer w0.6: 70.21,11.94 71.39,11.94
$1N282: length 1.4
  Top Layer w0.5: R64.1 75.45,21.74 75.47,21.76
$1N283: length 1.1
  Top Layer w0.5: 74.37,26.27 74.43,26.33 75.48,26.33

## Copper pours and planes (outline as drawn; the poured copper is in the pictures)
PGND on Inner1: 0,34.17 100,34.17 100,0 0,0
VCC+180V on Top Layer: 42.6,34.3 51.76,34.3 51.76,34.04 42.6,34.04
VCC+180V on Top Layer: 91.69,32.87 92.87,32.87 92.87,31.2 91.69,31.2
VCC+180V_EXT2 on Top Layer: 0.76,35.05 3.63,35.05 3.63,33.48 0.76,33.48
$1N186 on Top Layer: 41.33,31.76 42.98,31.76 42.98,29.22 41.33,29.22
$1N275 on Top Layer: 65.1,31.68 66.75,31.68 66.75,29.78 65.1,29.78
$1N360 on Top Layer: 89.56,28.97 92.53,28.97 92.53,27.83 89.56,27.83

Small or netless copper shapes (teardrops, artwork), in the pictures only: 1 on Top Layer, 3 on Bottom Layer
